# EAGLE design PGTNX05_daisy (EAGLE 9.6.0)
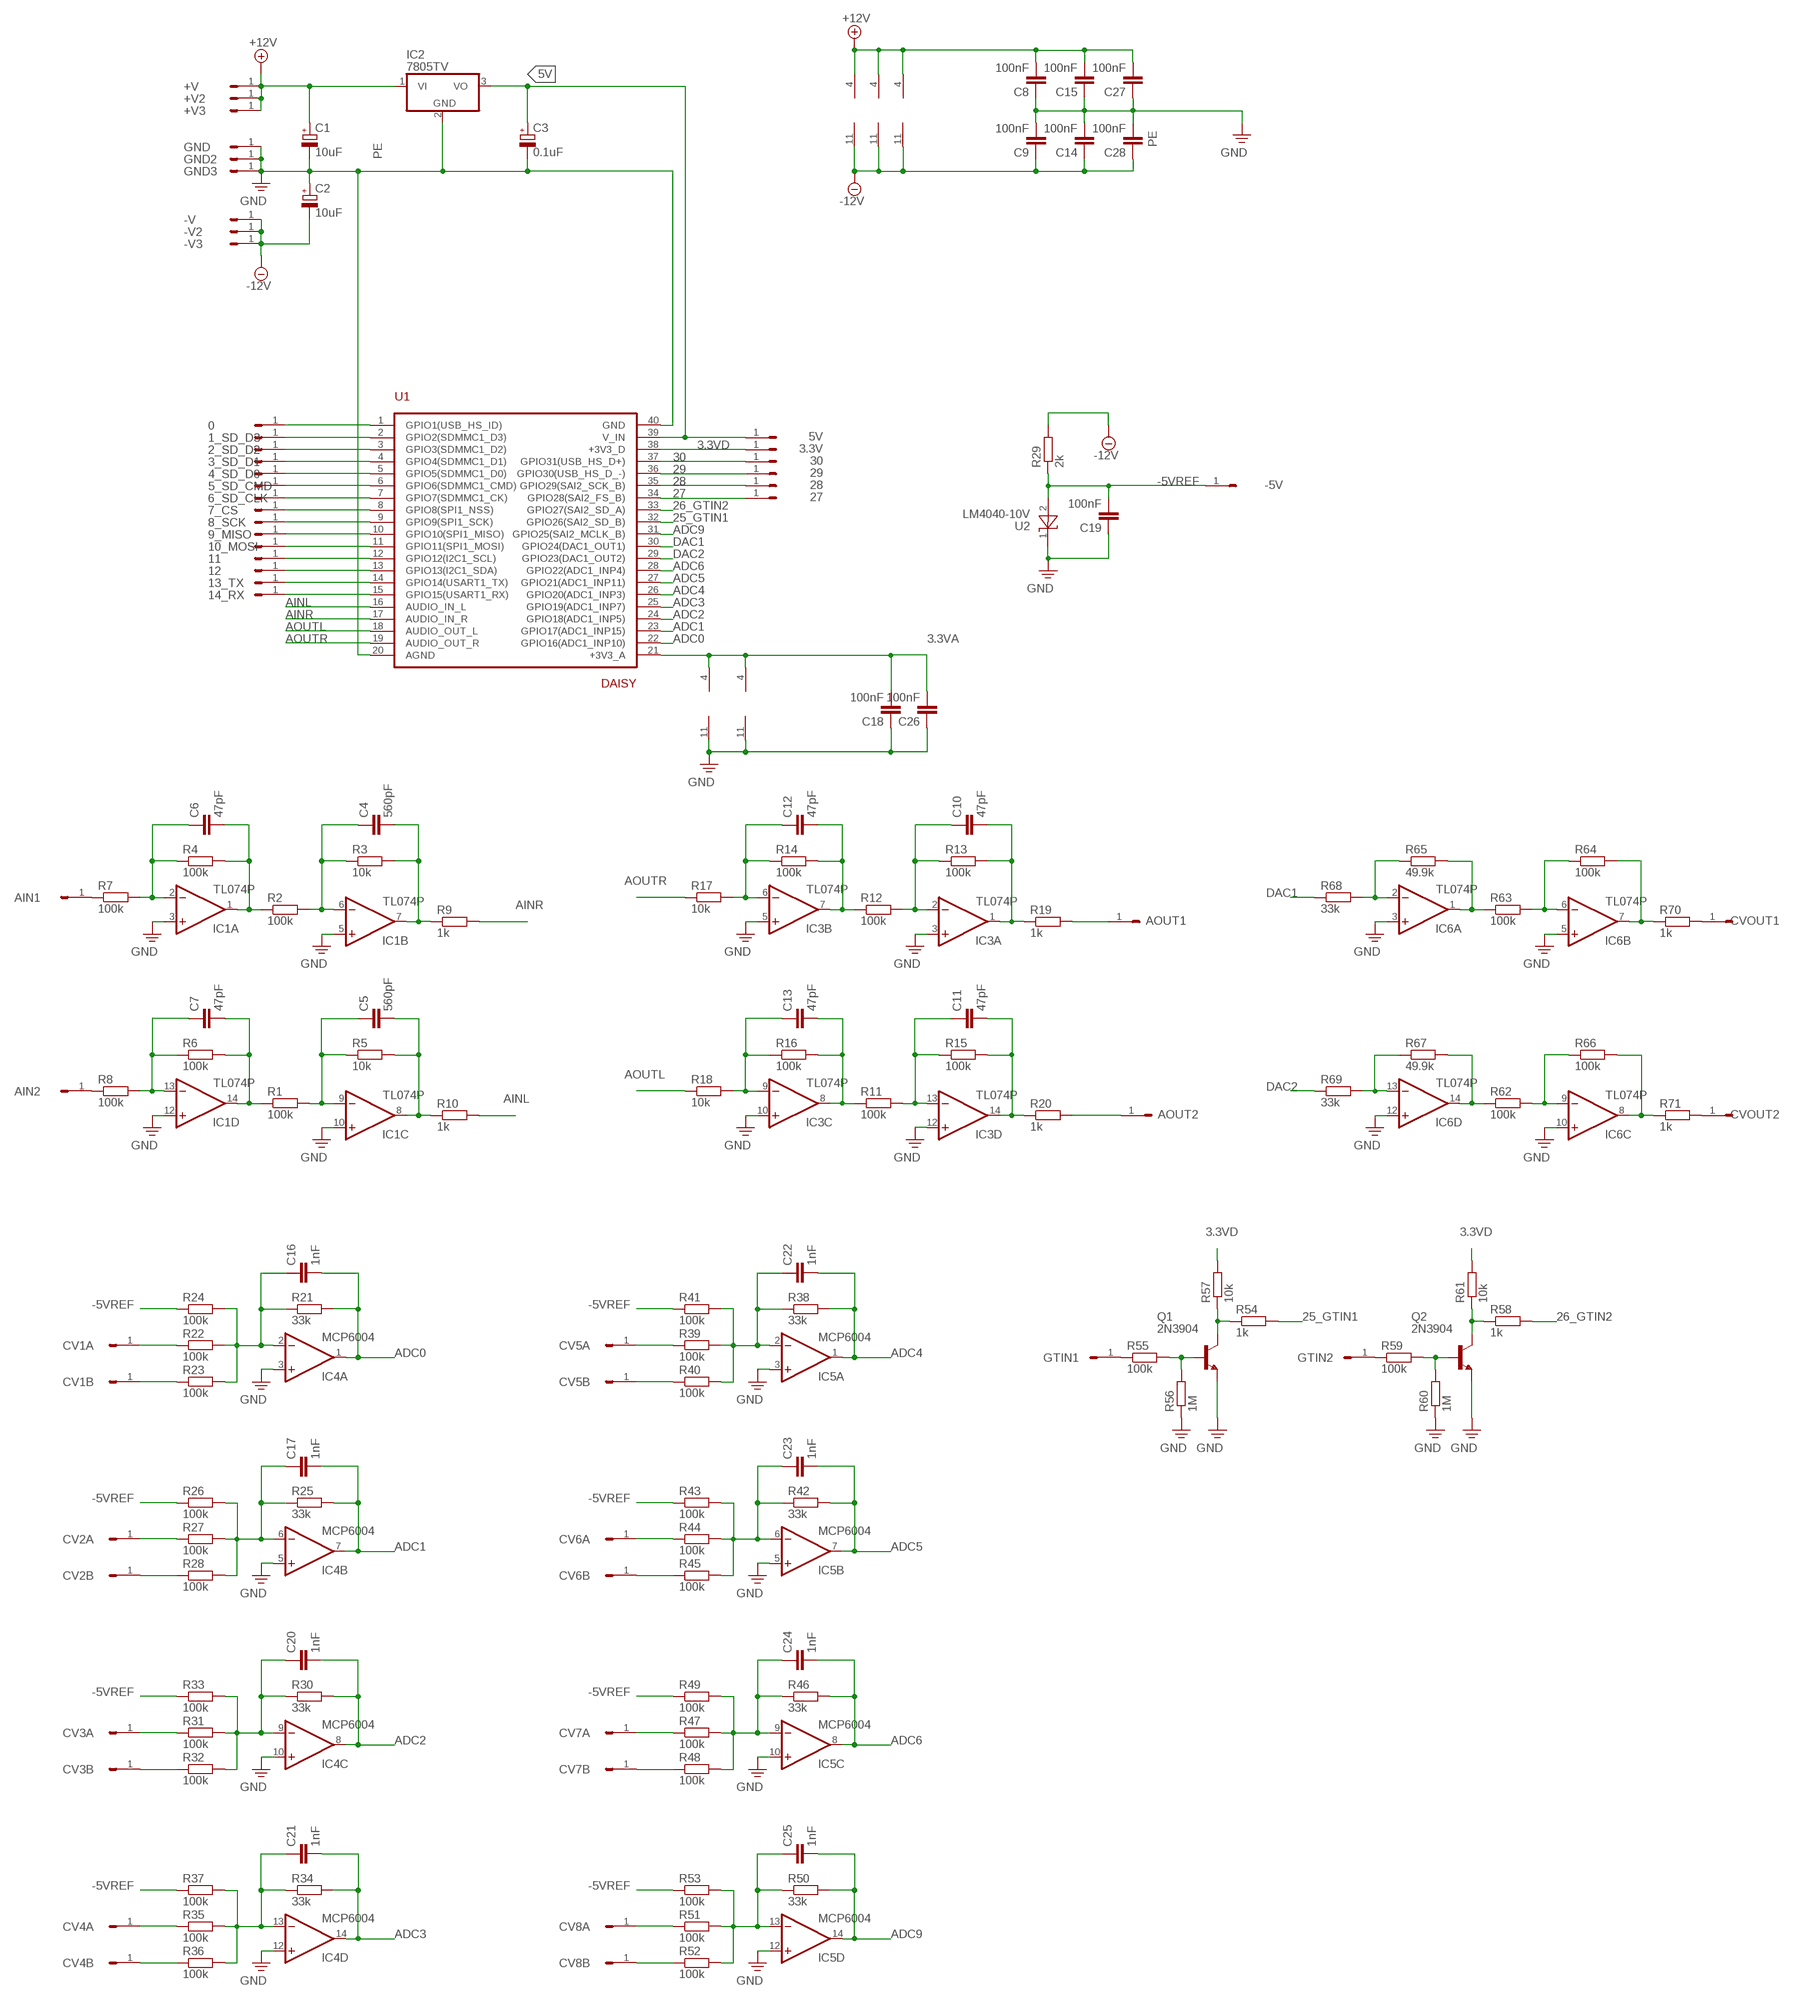
[diagram p0: schematic, sheet 1]

## Parts
0  HEADER/MALE/01  [HEADER/MALE/01]
1_SD_D3  HEADER/MALE/01  [HEADER/MALE/01]
2_SD_D2  HEADER/MALE/01  [HEADER/MALE/01]
3.3V  HEADER/MALE/01  [HEADER/MALE/01]
3_SD_D1  HEADER/MALE/01  [HEADER/MALE/01]
4_SD_D0  HEADER/MALE/01  [HEADER/MALE/01]
5_SD_CMD  HEADER/MALE/01  [HEADER/MALE/01]
5V  HEADER/MALE/01  [HEADER/MALE/01]
6_SD_CLK  HEADER/MALE/01  [HEADER/MALE/01]
7_CS  HEADER/MALE/01  [HEADER/MALE/01]
8_SCK  HEADER/MALE/01  [HEADER/MALE/01]
9_MISO  HEADER/MALE/01  [HEADER/MALE/01]
10_MOSI  HEADER/MALE/01  [HEADER/MALE/01]
11  HEADER/MALE/01  [HEADER/MALE/01]
12  HEADER/MALE/01  [HEADER/MALE/01]
13_TX  HEADER/MALE/01  [HEADER/MALE/01]
14_RX  HEADER/MALE/01  [HEADER/MALE/01]
27  HEADER/MALE/01  [HEADER/MALE/01]
28  HEADER/MALE/01  [HEADER/MALE/01]
29  HEADER/MALE/01  [HEADER/MALE/01]
30  HEADER/MALE/01  [HEADER/MALE/01]
+V  HEADER/MALE/01  [HEADER/MALE/01]
+V2  HEADER/MALE/01  [HEADER/MALE/01]
+V3  HEADER/MALE/01  [HEADER/MALE/01]
-5V  HEADER/MALE/01  [HEADER/MALE/01]
-V  HEADER/MALE/01  [HEADER/MALE/01]
-V2  HEADER/MALE/01  [HEADER/MALE/01]
-V3  HEADER/MALE/01  [HEADER/MALE/01]
AIN1  HEADER/MALE/01  [HEADER/MALE/01]
AIN2  HEADER/MALE/01  [HEADER/MALE/01]
AOUT1  HEADER/MALE/01  [HEADER/MALE/01]
AOUT2  HEADER/MALE/01  [HEADER/MALE/01]
C1  10uF  CAPACITOR/POLARIZEDE2.5-6  [E2,5-6]
C2  10uF  CAPACITOR/POLARIZEDE2.5-6  [E2,5-6]
C3  0.1uF  CAPACITOR/POLARIZEDE2.5-6  [E2,5-6]
C4  560pF  CAPACITORCERAMICDISC/5  [CERAMICDISC/5]
C5  560pF  CAPACITORCERAMICDISC/5  [CERAMICDISC/5]
C6  47pF  CAPACITORCERAMICDISC/5  [CERAMICDISC/5]
C7  47pF  CAPACITORCERAMICDISC/5  [CERAMICDISC/5]
C8  100nF  CAPACITORCERAMICDISC/5  [CERAMICDISC/5]
C9  100nF  CAPACITORCERAMICDISC/5  [CERAMICDISC/5]
C10  47pF  CAPACITORCERAMICDISC/5  [CERAMICDISC/5]
C11  47pF  CAPACITORCERAMICDISC/5  [CERAMICDISC/5]
C12  47pF  CAPACITORCERAMICDISC/5  [CERAMICDISC/5]
C13  47pF  CAPACITORCERAMICDISC/5  [CERAMICDISC/5]
C14  100nF  CAPACITORCERAMICDISC/5  [CERAMICDISC/5]
C15  100nF  CAPACITORCERAMICDISC/5  [CERAMICDISC/5]
C16  1nF  CAPACITORCERAMICDISC/5  [CERAMICDISC/5]
C17  1nF  CAPACITORCERAMICDISC/5  [CERAMICDISC/5]
C18  100nF  CAPACITORCERAMICDISC/5  [CERAMICDISC/5]
C19  100nF  CAPACITORCERAMICDISC/5  [CERAMICDISC/5]
C20  1nF  CAPACITORCERAMICDISC/5  [CERAMICDISC/5]
C21  1nF  CAPACITORCERAMICDISC/5  [CERAMICDISC/5]
C22  1nF  CAPACITORCERAMICDISC/5  [CERAMICDISC/5]
C23  1nF  CAPACITORCERAMICDISC/5  [CERAMICDISC/5]
C24  1nF  CAPACITORCERAMICDISC/5  [CERAMICDISC/5]
C25  1nF  CAPACITORCERAMICDISC/5  [CERAMICDISC/5]
C26  100nF  CAPACITORCERAMICDISC/5  [CERAMICDISC/5]
C27  100nF  CAPACITORCERAMICDISC/5  [CERAMICDISC/5]
C28  100nF  CAPACITORCERAMICDISC/5  [CERAMICDISC/5]
CV1A  HEADER/MALE/01  [HEADER/MALE/01]
CV1B  HEADER/MALE/01  [HEADER/MALE/01]
CV2A  HEADER/MALE/01  [HEADER/MALE/01]
CV2B  HEADER/MALE/01  [HEADER/MALE/01]
CV3A  HEADER/MALE/01  [HEADER/MALE/01]
CV3B  HEADER/MALE/01  [HEADER/MALE/01]
CV4A  HEADER/MALE/01  [HEADER/MALE/01]
CV4B  HEADER/MALE/01  [HEADER/MALE/01]
CV5A  HEADER/MALE/01  [HEADER/MALE/01]
CV5B  HEADER/MALE/01  [HEADER/MALE/01]
CV6A  HEADER/MALE/01  [HEADER/MALE/01]
CV6B  HEADER/MALE/01  [HEADER/MALE/01]
CV7A  HEADER/MALE/01  [HEADER/MALE/01]
CV7B  HEADER/MALE/01  [HEADER/MALE/01]
CV8A  HEADER/MALE/01  [HEADER/MALE/01]
CV8B  HEADER/MALE/01  [HEADER/MALE/01]
CVOUT1  HEADER/MALE/01  [HEADER/MALE/01]
CVOUT2  HEADER/MALE/01  [HEADER/MALE/01]
GND  HEADER/MALE/01  [HEADER/MALE/01]
GND2  HEADER/MALE/01  [HEADER/MALE/01]
GND3  HEADER/MALE/01  [HEADER/MALE/01]
GTIN1  HEADER/MALE/01  [HEADER/MALE/01]
GTIN2  HEADER/MALE/01  [HEADER/MALE/01]
IC1  TL074P  [DIL14]
IC2  7805TV  [TO220V]
IC3  TL074P  [DIL14]
IC4  MCP6004  TL074P  [DIL14]
IC5  MCP6004  TL074P  [DIL14]
IC6  TL074P  [DIL14]
Q1  2N3904  [TO92]
Q2  2N3904  [TO92]
R1  100k  RESISTORRESISTOR/UPRIGHT/7.5  [RESISTOR/7.5]
R2  100k  RESISTORRESISTOR/UPRIGHT/7.5  [RESISTOR/7.5]
R3  10k  RESISTORRESISTOR/UPRIGHT/7.5  [RESISTOR/7.5]
R4  100k  RESISTORRESISTOR/UPRIGHT/7.5  [RESISTOR/7.5]
R5  10k  RESISTORRESISTOR/UPRIGHT/7.5  [RESISTOR/7.5]
R6  100k  RESISTORRESISTOR/UPRIGHT/7.5  [RESISTOR/7.5]
R7  100k  RESISTORRESISTOR/UPRIGHT/7.5  [RESISTOR/7.5]
R8  100k  RESISTORRESISTOR/UPRIGHT/7.5  [RESISTOR/7.5]
R9  1k  RESISTORRESISTOR/UPRIGHT/7.5  [RESISTOR/7.5]
R10  1k  RESISTORRESISTOR/UPRIGHT/7.5  [RESISTOR/7.5]
R11  100k  RESISTORRESISTOR/UPRIGHT/7.5  [RESISTOR/7.5]
R12  100k  RESISTORRESISTOR/UPRIGHT/7.5  [RESISTOR/7.5]
R13  100k  RESISTORRESISTOR/UPRIGHT/7.5  [RESISTOR/7.5]
R14  100k  RESISTORRESISTOR/UPRIGHT/7.5  [RESISTOR/7.5]
R15  100k  RESISTORRESISTOR/UPRIGHT/7.5  [RESISTOR/7.5]
R16  100k  RESISTORRESISTOR/UPRIGHT/7.5  [RESISTOR/7.5]
R17  10k  RESISTORRESISTOR/UPRIGHT/7.5  [RESISTOR/7.5]
R18  10k  RESISTORRESISTOR/UPRIGHT/7.5  [RESISTOR/7.5]
R19  1k  RESISTORRESISTOR/UPRIGHT/7.5  [RESISTOR/7.5]
R20  1k  RESISTORRESISTOR/UPRIGHT/7.5  [RESISTOR/7.5]
R21  33k  RESISTORRESISTOR/UPRIGHT/7.5  [RESISTOR/7.5]
R22  100k  RESISTORRESISTOR/UPRIGHT/7.5  [RESISTOR/7.5]
R23  100k  RESISTORRESISTOR/UPRIGHT/7.5  [RESISTOR/7.5]
R24  100k  RESISTORRESISTOR/UPRIGHT/7.5  [RESISTOR/7.5]
R25  33k  RESISTORRESISTOR/UPRIGHT/7.5  [RESISTOR/7.5]
R26  100k  RESISTORRESISTOR/UPRIGHT/7.5  [RESISTOR/7.5]
R27  100k  RESISTORRESISTOR/UPRIGHT/7.5  [RESISTOR/7.5]
R28  100k  RESISTORRESISTOR/UPRIGHT/7.5  [RESISTOR/7.5]
R29  2k  RESISTORRESISTOR/UPRIGHT/7.5  [RESISTOR/7.5]
R30  33k  RESISTORRESISTOR/UPRIGHT/7.5  [RESISTOR/7.5]
R31  100k  RESISTORRESISTOR/UPRIGHT/7.5  [RESISTOR/7.5]
R32  100k  RESISTORRESISTOR/UPRIGHT/7.5  [RESISTOR/7.5]
R33  100k  RESISTORRESISTOR/UPRIGHT/7.5  [RESISTOR/7.5]
R34  33k  RESISTORRESISTOR/UPRIGHT/7.5  [RESISTOR/7.5]
R35  100k  RESISTORRESISTOR/UPRIGHT/7.5  [RESISTOR/7.5]
R36  100k  RESISTORRESISTOR/UPRIGHT/7.5  [RESISTOR/7.5]
R37  100k  RESISTORRESISTOR/UPRIGHT/7.5  [RESISTOR/7.5]
R38  33k  RESISTORRESISTOR/UPRIGHT/7.5  [RESISTOR/7.5]
R39  100k  RESISTORRESISTOR/UPRIGHT/7.5  [RESISTOR/7.5]
R40  100k  RESISTORRESISTOR/UPRIGHT/7.5  [RESISTOR/7.5]
R41  100k  RESISTORRESISTOR/UPRIGHT/7.5  [RESISTOR/7.5]
R42  33k  RESISTORRESISTOR/UPRIGHT/7.5  [RESISTOR/7.5]
R43  100k  RESISTORRESISTOR/UPRIGHT/7.5  [RESISTOR/7.5]
R44  100k  RESISTORRESISTOR/UPRIGHT/7.5  [RESISTOR/7.5]
R45  100k  RESISTORRESISTOR/UPRIGHT/7.5  [RESISTOR/7.5]
R46  33k  RESISTORRESISTOR/UPRIGHT/7.5  [RESISTOR/7.5]
R47  100k  RESISTORRESISTOR/UPRIGHT/7.5  [RESISTOR/7.5]
R48  100k  RESISTORRESISTOR/UPRIGHT/7.5  [RESISTOR/7.5]
R49  100k  RESISTORRESISTOR/UPRIGHT/7.5  [RESISTOR/7.5]
R50  33k  RESISTORRESISTOR/UPRIGHT/7.5  [RESISTOR/7.5]
R51  100k  RESISTORRESISTOR/UPRIGHT/7.5  [RESISTOR/7.5]
R52  100k  RESISTORRESISTOR/UPRIGHT/7.5  [RESISTOR/7.5]
R53  100k  RESISTORRESISTOR/UPRIGHT/7.5  [RESISTOR/7.5]
R54  1k  RESISTORRESISTOR/UPRIGHT/7.5  [RESISTOR/7.5]
R55  100k  RESISTORRESISTOR/UPRIGHT/7.5  [RESISTOR/7.5]
R56  1M  RESISTORRESISTOR/UPRIGHT/7.5  [RESISTOR/7.5]
R57  10k  RESISTORRESISTOR/UPRIGHT/7.5  [RESISTOR/7.5]
R58  1k  RESISTORRESISTOR/UPRIGHT/7.5  [RESISTOR/7.5]
R59  100k  RESISTORRESISTOR/UPRIGHT/7.5  [RESISTOR/7.5]
R60  1M  RESISTORRESISTOR/UPRIGHT/7.5  [RESISTOR/7.5]
R61  10k  RESISTORRESISTOR/UPRIGHT/7.5  [RESISTOR/7.5]
R62  100k  RESISTORRESISTOR/UPRIGHT/7.5  [RESISTOR/7.5]
R63  100k  RESISTORRESISTOR/UPRIGHT/7.5  [RESISTOR/7.5]
R64  100k  RESISTORRESISTOR/UPRIGHT/7.5  [RESISTOR/7.5]
R65  49.9k  RESISTORRESISTOR/UPRIGHT/7.5  [RESISTOR/7.5]
R66  100k  RESISTORRESISTOR/UPRIGHT/7.5  [RESISTOR/7.5]
R67  49.9k  RESISTORRESISTOR/UPRIGHT/7.5  [RESISTOR/7.5]
R68  33k  RESISTORRESISTOR/UPRIGHT/7.5  [RESISTOR/7.5]
R69  33k  RESISTORRESISTOR/UPRIGHT/7.5  [RESISTOR/7.5]
R70  1k  RESISTORRESISTOR/UPRIGHT/7.5  [RESISTOR/7.5]
R71  1k  RESISTORRESISTOR/UPRIGHT/7.5  [RESISTOR/7.5]
U1  DAISY  ES_DAISY_SEED_REV4  [ES_DAISY_SEED]
U2  LM4040-10V  LM4040CYM3-2.5  [SOT-23]

## Nets
3.3VA: C18.2 C26.2 IC4.4(P:V+) IC5.4(P:V+) U1.21(+3V3_A)
3.3VD: 3.3V.1 R57.2 R61.2 U1.38(+3V3_D)
5V: 5V.1 C3.+ IC2.3(VO) U1.39(V_IN)
25_GTIN1: R54.2 U1.32(GPIO26(SAI2_SD_B))
26_GTIN2: R58.2 U1.33(GPIO27(SAI2_SD_A))
27: 27.1 U1.34(GPIO28(SAI2_FS_B))
28: 28.1 U1.35(GPIO29(SAI2_SCK_B))
29: 29.1 U1.36(GPIO30(USB_HS_D_-))
30: 30.1 U1.37(GPIO31(USB_HS_D+))
+12V: +V2.1 +V3.1 +V.1 C1.+ C8.2 C15.2 C27.2 IC1.4(P:V+) IC2.1(VI) IC3.4(P:V+) IC6.4(P:V+)
-5VREF: -5V.1 C19.2 R24.1 R26.1 R29.1 R33.1 R37.1 R41.1 R43.1 R49.1 R53.1 U2.2(A)
-12V: -V2.1 -V3.1 -V.1 C2.- C9.1 C14.1 C28.1 IC1.11(P:V-) IC3.11(P:V-) IC6.11(P:V-) R29.2
ADC0: C16.2 IC4.1(A:OUT) R21.2 U1.22(GPIO16(ADC1_INP10))
ADC1: C17.2 IC4.7(B:OUT) R25.2 U1.23(GPIO17(ADC1_INP15))
ADC2: C20.2 IC4.8(C:OUT) R30.2 U1.24(GPIO18(ADC1_INP5))
ADC3: C21.2 IC4.14(D:OUT) R34.2 U1.25(GPIO19(ADC1_INP7))
ADC4: C22.2 IC5.1(A:OUT) R38.2 U1.26(GPIO20(ADC1_INP3))
ADC5: C23.2 IC5.7(B:OUT) R42.2 U1.27(GPIO21(ADC1_INP11))
ADC6: C24.2 IC5.8(C:OUT) R46.2 U1.28(GPIO22(ADC1_INP4))
ADC9: C25.2 IC5.14(D:OUT) R50.2 U1.31(GPIO25(SAI2_MCLK_B))
AINL: R10.2 U1.16(AUDIO_IN_L)
AINR: R9.2 U1.17(AUDIO_IN_R)
AOUTL: R18.1 U1.18(AUDIO_OUT_L)
AOUTR: R17.1 U1.19(AUDIO_OUT_R)
DAC1: R68.1 U1.30(GPIO24(DAC1_OUT1))
DAC2: R69.1 U1.29(GPIO23(DAC1_OUT2))
N$1: CV2A.1 R27.1
N$2: C7.2 IC1.14(D:OUT) R1.1 R6.2
N$3: C6.2 IC1.1(A:OUT) R2.1 R4.2
N$4: C4.1 IC1.6(B:-IN) R2.2 R3.1
N$5: C5.1 IC1.9(C:-IN) R1.2 R5.1
N$6: AIN1.1 R7.1
N$7: AIN2.1 R8.1
N$8: C7.1 IC1.13(D:-IN) R6.1 R8.2
N$9: C5.2 IC1.8(C:OUT) R5.2 R10.1
N$10: C4.2 IC1.7(B:OUT) R3.2 R9.1
N$11: AOUT1.1 R19.2
N$12: C12.2 IC3.7(B:OUT) R12.1 R14.2
N$13: C6.1 IC1.2(A:-IN) R4.1 R7.2
N$14: C10.1 IC3.2(A:-IN) R12.2 R13.1
N$15: C13.2 IC3.8(C:OUT) R11.1 R16.2
N$16: C11.1 IC3.13(D:-IN) R11.2 R15.1
N$17: C13.1 IC3.9(C:-IN) R16.1 R18.2
N$18: C11.2 IC3.14(D:OUT) R15.2 R20.1
N$19: C10.2 IC3.1(A:OUT) R13.2 R19.1
N$20: C12.1 IC3.6(B:-IN) R14.1 R17.2
N$21: AOUT2.1 R20.2
N$22: CV1A.1 R22.1
N$23: 14_RX.1 U1.15(GPIO15(USART1_RX))
N$24: C16.1 IC4.2(A:-IN) R21.1 R22.2 R23.2 R24.2
N$25: GTIN2.1 R59.1
N$26: CV2B.1 R28.1
N$27: CV1B.1 R23.1
N$28: 13_TX.1 U1.14(GPIO14(USART1_TX))
N$29: C17.1 IC4.6(B:-IN) R25.1 R26.2 R27.2 R28.2
N$30: C21.1 IC4.13(D:-IN) R34.1 R35.2 R36.2 R37.2
N$31: CV4A.1 R35.1
N$32: CV4B.1 R36.1
N$33: 10_MOSI.1 U1.11(GPIO11(SPI1_MOSI))
N$34: CV3B.1 R32.1
N$35: CV3A.1 R31.1
N$36: C20.1 IC4.9(C:-IN) R30.1 R31.2 R32.2 R33.2
N$37: 9_MISO.1 U1.10(GPIO10(SPI1_MISO))
N$38: C22.1 IC5.2(A:-IN) R38.1 R39.2 R40.2 R41.2
N$39: 8_SCK.1 U1.9(GPIO9(SPI1_SCK))
N$40: CV5B.1 R40.1
N$41: CV5A.1 R39.1
N$42: 7_CS.1 U1.8(GPIO8(SPI1_NSS))
N$43: C23.1 IC5.6(B:-IN) R42.1 R43.2 R44.2 R45.2
N$44: CV6A.1 R44.1
N$45: CV6B.1 R45.1
N$46: C25.1 IC5.13(D:-IN) R50.1 R51.2 R52.2 R53.2
N$47: 6_SD_CLK.1 U1.7(GPIO7(SDMMC1_CK))
N$48: CV8A.1 R51.1
N$49: CV8B.1 R52.1
N$50: CV7B.1 R48.1
N$51: CV7A.1 R47.1
N$52: C24.1 IC5.9(C:-IN) R46.1 R47.2 R48.2 R49.2
N$53: 5_SD_CMD.1 U1.6(GPIO6(SDMMC1_CMD))
N$54: GTIN1.1 R55.1
N$55: Q1.2(B) R55.2 R56.2
N$56: Q1.1(C) R54.1 R57.1
N$58: Q2.2(B) R59.2 R60.2
N$59: Q2.1(C) R58.1 R61.1
N$61: 4_SD_D0.1 U1.5(GPIO5(SDMMC1_D0))
N$62: 3_SD_D1.1 U1.4(GPIO4(SDMMC1_D1))
N$63: 2_SD_D2.1 U1.3(GPIO3(SDMMC1_D2))
N$64: 1_SD_D3.1 U1.2(GPIO2(SDMMC1_D3))
N$65: 0.1 U1.1(GPIO1(USB_HS_ID))
N$66: 11.1 U1.12(GPIO12(I2C1_SCL))
N$67: 12.1 U1.13(GPIO13(I2C1_SDA))
N$69: IC6.1(A:OUT) R63.1 R65.2
N$70: IC6.6(B:-IN) R63.2 R64.1
N$71: IC6.14(D:OUT) R62.1 R67.2
N$72: IC6.9(C:-IN) R62.2 R66.1
N$73: IC6.13(D:-IN) R67.1 R69.2
N$74: IC6.8(C:OUT) R66.2 R71.1
N$75: IC6.7(B:OUT) R64.2 R70.1
N$76: IC6.2(A:-IN) R65.1 R68.2
N$77: CVOUT1.1 R70.2
N$78: CVOUT2.1 R71.2
PE: C1.- C2.+ C3.- C8.1 C9.2 C14.2 C15.1 C18.1 C19.1 C26.1 C27.1 C28.2 GND2.1 GND3.1 GND.1 IC1.3(A:+IN) IC1.5(B:+IN) IC1.10(C:+IN) IC1.12(D:+IN) IC2.2(GND) IC3.3(A:+IN) IC3.5(B:+IN) IC3.10(C:+IN) IC3.12(D:+IN) IC4.3(A:+IN) IC4.5(B:+IN) IC4.10(C:+IN) IC4.11(P:V-) IC4.12(D:+IN) IC5.3(A:+IN) IC5.5(B:+IN) IC5.10(C:+IN) IC5.11(P:V-) IC5.12(D:+IN) IC6.3(A:+IN) IC6.5(B:+IN) IC6.10(C:+IN) IC6.12(D:+IN) Q1.3(E) Q2.3(E) R56.1 R60.1 U1.20(AGND) U1.40(GND) U2.1(C) ; supply symbol labelled GND

## Library data of the parts
0 1_SD_D3 2_SD_D2 3.3V 3_SD_D1 4_SD_D0 5_SD_CMD 5V 6_SD_CLK 7_CS 8_SCK 9_MISO 10_MOSI 11 12 13_TX 14_RX 27-30 +V +V2 +V3 -5V -V -V2 -V3 AIN1 AIN2 AOUT1 AOUT2 CV1A CV1B CV2A CV2B CV3A CV3B CV4A CV4B CV5A CV5B CV6A CV6B CV7A CV7B CV8A CV8B CVOUT1 CVOUT2 GND GND2 GND3 GTIN1 GTIN2 = connectors:HEADER/MALE/01; SPICEPREFIX: X
C1-C3 = capacitors:CAPACITOR/POLARIZED: POLARIZED CAPACITOR, European symbol; SPICEPREFIX: C
C4-C28 = capacitors:CAPACITOR: CAPACITOR, European symbol
IC1 IC3-IC6 = ic_analogue:TL074: OP AMP
IC2 = ic_voltage_reg:78*: Positive VOLTAGE REGULATOR Source: http://cache.national.com/ds/LM/LM78L05.pdf http://www.fairchildsemi.com/ds/LM/LM7805.pdf
Q1 Q2 = transistors:2N3904: NPN Transistor
R1-R71 = resistors:RESISTOR: RESISTOR, European symbol
U1 = Electrosmith-Boards:ES_DAISY_SEED_REV4; IPN: Daisy Seed
U2 = ic_voltage_reg:LM4040

## Board
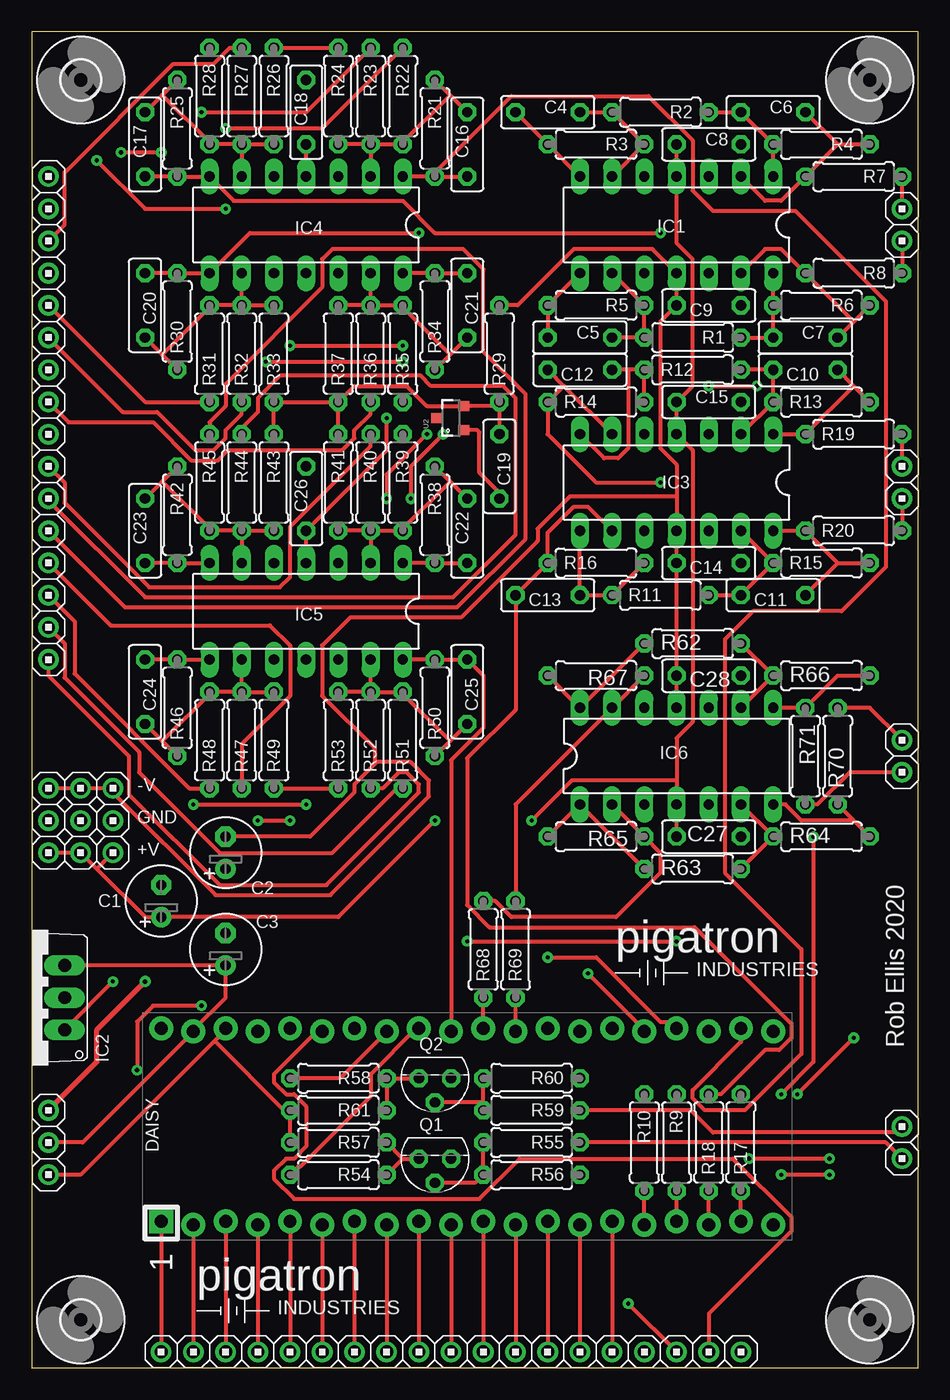
[diagram p1: board, top side]
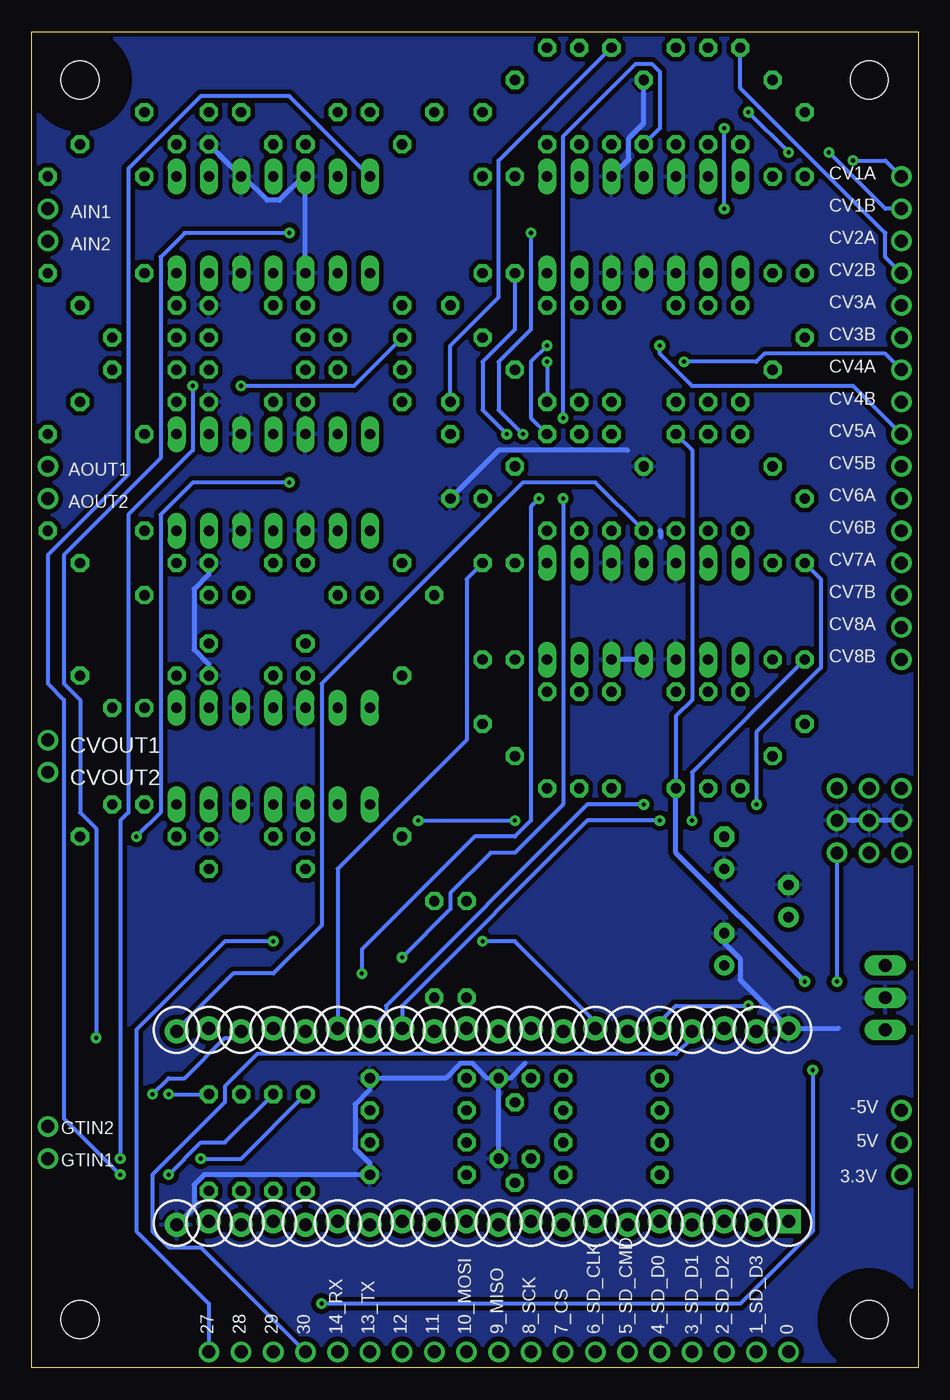
[diagram p2: board, bottom side, seen from below]

Size 69.9 x 105.4 mm. Coordinates in mm from the lower left corner, seen from the top.
Outline: 69.9,105.4 0,105.4 0,0 69.9,0 69.9,105.4
Copper layers (1*16): Top 0.0356mm / dielectric 1.5011mm / Bottom 0.0356mm
Design rules "pigatron": minimum track width 12mil, minimum drill 13mil, track to track 15mil, track to pad 10mil, pad to pad 10mil, via to via 10mil, smd to smd 6mil, copper to edge 15mil, drill to drill 10mil, minimum pad ring 12mil, minimum via ring 10mil, stop-mask expansion 4mil, vias tented up to drill 0mil, thermal gap 10mil

### Footprints (pad centres in the part's own frame; a part is rotated, then mirrored left to right if it is on the bottom)
HEADER/MALE/01 = drill 1.016: 1 0,0
E2,5-6 = drill 0.813 pad 1.6: + -1.27,0 | drill 0.813 pad 1.6 octagon: - 1.27,0
CERAMICDISC/5 = drill 0.813 octagon: 1 -2.54,0; 2 2.54,0
DIL14 = drill 0.813 long: 1 -7.62,-3.81; 2 -5.08,-3.81; 3 -2.54,-3.81; 4 0,-3.81; 5 2.54,-3.81; 6 5.08,-3.81; 7 7.62,-3.81; 8 7.62,3.81; 9 5.08,3.81; 10 2.54,3.81; 11 0,3.81; 12 -2.54,3.81; 13 -5.08,3.81; 14 -7.62,3.81
TO220V = drill 1.016 long: 1 -2.54,-2.54; 2 0,-2.54; 3 2.54,-2.54
TO92 = drill 0.813 octagon: 1 1.27,0; 2 0,1.905; 3 -1.27,0
RESISTOR/7.5 = drill 0.813 octagon: 1 -3.81,0; 2 3.81,0
ES_DAISY_SEED = drill 1.016 pad 1.88 square: 1 -7.493,24.13 | drill 1.016 pad 1.88: 2 -7.747,21.59; 3 -7.493,19.05; 4 -7.747,16.51; 5 -7.493,13.97; 6 -7.747,11.43; 7 -7.493,8.89; 8 -7.747,6.35; 9 -7.493,3.81; 10 -7.747,1.27; 11 -7.493,-1.27; 12 -7.747,-3.81; 13 -7.493,-6.35; 14 -7.747,-8.89; 15 -7.493,-11.43; 16 -7.747,-13.97; 17 -7.493,-16.51; 18 -7.747,-19.05; 19 -7.493,-21.59; 20 -7.747,-24.13; 21 7.493,-24.13; 22 7.747,-21.59; 23 7.493,-19.05; 24 7.747,-16.51; 25 7.493,-13.97; 26 7.747,-11.43; 27 7.493,-8.89; 28 7.747,-6.35; 29 7.493,-3.81; 30 7.747,-1.27; 31 7.493,1.27; 32 7.747,3.81; 33 7.493,6.35; 34 7.747,8.89; 35 7.493,11.43; 36 7.747,13.97; 37 7.493,16.51; 38 7.747,19.05; 39 7.493,21.59; 40 7.747,24.13
SOT-23 = smd 0.8 x 0.9: 1 -0.95,-1; 2 0.95,-1; 3 0,1.1
STANDOFF/3.0 = hole 3: 0,0

### Placement (x,y rotation side)
0  10.21,1.26 90 top
1_SD_D3  12.75,1.26 90 top
2_SD_D2  15.29,1.26 90 top
3.3V  1.32,15.23 270 top
3_SD_D1  17.83,1.26 90 top
4_SD_D0  20.37,1.26 90 top
5_SD_CMD  22.91,1.26 90 top
5V  1.32,17.77 180 top
6_SD_CLK  25.45,1.26 90 top
7_CS  27.99,1.26 90 top
8_SCK  30.53,1.26 90 top
9_MISO  33.07,1.26 90 top
10_MOSI  35.61,1.26 90 top
11  38.15,1.26 90 top
12  40.69,1.26 90 top
13_TX  43.23,1.26 90 top
14_RX  45.77,1.26 90 top
27  55.93,1.26 90 top
28  53.39,1.26 90 top
29  50.85,1.26 90 top
30  48.31,1.26 90 top
+V  6.4,40.63 0 top
+V2  3.86,40.63 180 top
+V3  1.32,40.63 180 top
-5V  1.32,20.31 0 top
-V  6.4,45.71 0 top
-V2  3.86,45.71 180 top
-V3  1.32,45.71 180 top
AIN1  68.63,91.43 180 top
AIN2  68.63,88.89 180 top
AOUT1  68.63,71.11 180 top
AOUT2  68.63,68.57 180 top
C1  10.21,36.82 90 top
C2  15.29,40.63 90 top
C3  15.29,33.01 90 top
C4  40.69,99.05 180 top
C5  43.23,81.27 180 top
C6  58.47,99.05 180 top
C7  61.01,81.27 180 top
C8  53.39,96.51 180 top
C9  53.39,83.81 0 top
C10  61.01,78.73 0 top
C11  58.47,60.95 0 top
C12  43.23,78.73 0 top
C13  40.69,60.95 0 top
C14  53.39,63.49 0 top
C15  53.39,76.19 180 top
C16  34.34,96.51 270 top
C17  8.94,96.51 270 top
C18  21.64,99.05 270 top
C19  36.88,71.11 90 top
C20  8.94,83.81 90 top
C21  34.34,83.81 90 top
C22  34.34,66.03 270 top
C23  8.94,66.03 270 top
C24  8.94,53.33 90 top
C25  34.34,53.33 90 top
C26  21.64,68.57 270 top
C27  53.39,41.9 180 top
C28  53.39,54.6 0 top
CV1A  1.32,93.97 0 top
CV1B  1.32,91.43 0 top
CV2A  1.32,88.89 0 top
CV2B  1.32,86.35 0 top
CV3A  1.32,83.81 0 top
CV3B  1.32,81.27 0 top
CV4A  1.32,78.73 0 top
CV4B  1.32,76.19 0 top
CV5A  1.32,73.65 0 top
CV5B  1.32,71.11 0 top
CV6A  1.32,68.57 0 top
CV6B  1.32,66.03 0 top
CV7A  1.32,63.49 0 top
CV7B  1.32,60.95 0 top
CV8A  1.32,58.41 0 top
CV8B  1.32,55.87 0 top
CVOUT1  68.63,49.52 180 top
CVOUT2  68.63,46.98 180 top
GND  6.4,43.17 0 top
GND2  1.32,43.17 180 top
GND3  3.86,43.17 180 top
GTIN1  68.63,16.5 180 top
GTIN2  68.63,19.04 180 top
IC1  50.85,90.16 180 top
IC2  0.05,29.2 90 top
IC3  50.85,69.84 180 top
IC4  21.64,90.16 180 top
IC5  21.64,59.68 180 top
IC6  50.85,48.25 0 top
Q1  31.8,16.5 180 top
Q2  31.8,22.85 180 top
R1  52.12,81.27 180 top
R2  49.58,99.05 180 top
R3  44.5,96.51 180 top
R4  62.28,96.51 180 top
R5  44.5,83.81 180 top
R6  62.28,83.81 180 top
R7  64.82,93.97 180 top
R8  64.82,86.35 180 top
R9  50.85,17.77 270 top
R10  48.31,17.77 270 top
R11  49.58,60.95 0 top
R12  52.12,78.73 0 top
R13  62.28,76.19 0 top
R14  44.5,76.19 0 top
R15  62.28,63.49 0 top
R16  44.5,63.49 0 top
R17  55.93,17.77 90 top
R18  53.39,17.77 90 top
R19  64.82,73.65 0 top
R20  64.82,66.03 0 top
R21  31.8,97.78 270 top
R22  29.26,100.32 270 top
R23  26.72,100.32 270 top
R24  24.18,100.32 270 top
R25  11.48,97.78 270 top
R26  19.1,100.32 270 top
R27  16.56,100.32 270 top
R28  14.02,100.32 270 top
R29  36.88,80 90 top
R30  11.48,82.54 90 top
R31  14.02,80 90 top
R32  16.56,80 90 top
R33  19.1,80 90 top
R34  31.8,82.54 90 top
R35  29.26,80 90 top
R36  26.72,80 90 top
R37  24.18,80 90 top
R38  31.8,67.3 270 top
R39  29.26,69.84 270 top
R40  26.72,69.84 270 top
R41  24.18,69.84 270 top
R42  11.48,67.3 270 top
R43  19.1,69.84 270 top
R44  16.56,69.84 270 top
R45  14.02,69.84 270 top
R46  11.48,52.06 90 top
R47  16.56,49.52 90 top
R48  14.02,49.52 90 top
R49  19.1,49.52 90 top
R50  31.8,52.06 90 top
R51  29.26,49.52 90 top
R52  26.72,49.52 90 top
R53  24.18,49.52 90 top
R54  24.18,15.23 180 top
R55  39.42,17.77 180 top
R56  39.42,15.23 180 top
R57  24.18,17.77 180 top
R58  24.18,22.85 180 top
R59  39.42,20.31 180 top
R60  39.42,22.85 180 top
R61  24.18,20.31 180 top
R62  52.12,57.14 0 top
R63  52.12,39.36 0 top
R64  62.28,41.9 0 top
R65  44.5,41.9 180 top
R66  62.28,54.6 0 top
R67  44.5,54.6 180 top
R68  35.61,33.01 90 top
R69  38.15,33.01 90 top
R70  63.55,48.25 90 top
R71  61.01,48.25 270 top
U1  34.34,19.04 90 top
U2  33.07,74.92 90 top
U$1  [PIGATRON-LOGO]  21.89,6.09 0 top
U$2  [STANDOFF/3.0]  66.09,3.8 180 top
U$3  [STANDOFF/3.0]  3.86,3.8 180 top
U$4  [STANDOFF/3.0]  3.86,101.59 0 top
U$5  [PIGATRON-LOGO]  54.91,32.76 0 top
U$7  [STANDOFF/3.0]  66.09,101.59 0 top

### Tracks (layer width: path | path; a pad name or v marks a point on that pad's centre or on a via)
3.3VA  (via drill 0.33)
  Top 0.305: IC4.4 C18.2 | IC5.4 C26.2 27.99,72.38 v27.99,74.92
  Bottom 0.305: C18.2 20.37,97.78 20.37,102.22 21.01,102.86 22.28,102.86 27.99,97.14 v27.99,74.92 | C26.2 25.45,69.84 31.17,69.84 47.04,53.97 47.04,34.91 50.85,31.1 54.03,31.1 58.47,26.66 U1.21
3.3VD
  Top 0.305: R57.2 R61.2 19.89,20.31 14.42,25.79 | 3.3V.1 3.86,15.23 14.42,25.79 | 14.42,25.79 15.29,26.66 U1.38
5V
  Top 0.305: IC2.3 C3.+ 15.29,29.2 12.75,26.66 U1.39 12.75,26.5 4.02,17.77 5V.1
25_GTIN1
  Top 0.305: R54.2 21.01,15.87 21.16,15.87 26.72,21.42 26.72,23.17 30.21,26.66 30.53,26.66 U1.32
26_GTIN2
  Top 0.305: R58.2 24.34,22.85 27.99,26.5 U1.33
27  (via drill 0.33)
  Top 0.305: v34.34,33.65 v50.85,33.65
  Bottom 0.305: 27.1 55.93,5.07 61.65,10.79 61.65,26.66 54.66,33.65 v50.85,33.65 | v34.34,33.65 31.8,33.65 25.45,27.29 U1.34
28
  Top 0.305: 28.1 53.39,4.28 59.9,10.79 59.9,11.9 55.3,16.5 38.47,16.5 35.29,13.33 20.69,13.33 19.1,14.91 19.1,15.55 20.05,16.5 20.69,16.5 21.64,17.45 21.64,20.63 20.69,21.58 20.05,21.58 19.1,22.53 19.1,23.17 22.43,26.5 22.91,26.5 U1.35
29  (via drill 0.33)
  Top 0.305: v47.04,5.07 29.1 | v8.31,23.48 8.31,27.29 9.58,28.56 v13.39,28.56
  Bottom 0.305: v47.04,5.07 14.02,5.07 8.31,10.79 v8.31,23.48 | v13.39,28.56 19.1,28.56 20.37,27.29 U1.36
30
  Bottom 0.305: 30.1 56.57,9.52 59.11,9.52 60.38,10.79 60.38,15.23 54.66,20.94 54.66,22.21 52.12,24.75 19.1,24.75 17.83,26.02 U1.37
+12V  (via drill 0.33)
  Top 0.305: C27.2 IC6.4 50.85,46.34 | C8.2 IC1.4 50.85,88.73 52.12,87.46 52.12,77.46 C15.2 IC3.4 52.12,72.38 52.12,50.95 50.85,49.68 50.85,46.34 | 5.13,39.36 +V2.1 +V3.1 | 5.13,39.36 8.94,35.55 C1.+ 24.18,35.55 v31.8,43.17 | 5.13,39.36 +V.1 | v6.4,30.47 IC2.1 | v39.42,43.17 42.6,46.34 50.85,46.34
  Bottom 0.305: +V.1 v6.4,30.47 | v39.42,43.17 v31.8,43.17
-5VREF  (via drill 0.35)
  Top 0.305: R49.1 R53.1 | C19.2 R29.1 36.56,75.87 34.18,75.87 U2.2 34.02,75.87 31.17,75.87 29.58,77.46 25.45,77.46 R37.1 | R41.1 R37.1 | R43.1 R33.1 R37.1 | R26.1 R24.1
  Top 0.406: -5V.1 5.13,24.12 5.13,26.66 v8.94,30.47
  Bottom 0.305: R24.1 33.07,95.24 33.07,84.44 36.88,80.63 R29.1 | R49.1 19.1,51.43 17.83,52.7 17.83,72.38 R43.1
  Bottom 0.406: v8.94,30.47 19.1,40.63 R49.1
-12V
  Top 0.305: C2.- 21.96,41.9 25.45,45.39 25.45,46.03 27.12,47.69 | 27.12,47.69 27.2,47.77 29.9,47.77 31.32,46.34 31.32,45.08 23.55,37.3 14.5,37.3 6.4,45.39 -V.1 -V2.1 -V3.1 | IC6.11 C28.1 C14.1 IC3.11 50.85,68.73 | R29.2 38.31,83.81 42.76,88.25 48.95,88.25 IC1.11 C9.1 49.58,82.54 49.58,72.54 50.85,71.27 50.85,68.73 | 50.85,68.73 42.44,68.73 39.9,66.19 39.9,65.24 33.87,59.2 25.13,59.2 22.91,56.98 22.91,53.01 27.04,48.89 27.04,47.77 27.12,47.69
ADC0
  Top 0.305: C16.2 R21.2 31.48,93.97 | 31.48,93.97 IC4.1 | U1.22 55.93,25.71 52.12,21.9 52.12,21.26 53.07,20.31 56.25,20.31 60.69,24.75 60.69,33.01 54.66,39.04 54.66,57.46 56.88,59.68 63.87,59.68 67.36,63.17 67.36,84.13 60.22,91.27 53.71,91.27 52.12,92.86 52.12,96.83 48.63,100.32 37.83,100.32 31.48,93.97
ADC1  (via drill 0.33)
  Top 0.305: C17.2 R25.2 IC4.7 15.93,92.06 29.26,92.06 31.8,89.52 v49.58,89.52 | v64.82,26.02 v60.38,21.58
  Bottom 0.305: v60.38,21.58 59.11,22.85 57.84,22.85 54.66,26.02 53.39,26.02 U1.23 | v64.82,26.02 64.82,42.54 66.09,43.8 66.09,52.7 67.36,53.97 67.36,64.12 59.74,71.74 59.74,87.62 57.84,89.52 v49.58,89.52
ADC2  (via drill 0.33)
  Top 0.305: C20.2 R30.2 IC4.8 17.2,89.52 v30.53,89.52 | v40.69,32.38 44.5,32.38 49.58,27.29 50.85,27.29 U1.24 | v27.99,68.57 27.99,70.47 v31.17,73.65
  Bottom 0.305: v40.69,32.38 36.88,36.19 36.88,37.46 33.71,40.63 31.8,40.63 27.99,44.44 v27.99,68.57 | v31.17,73.65 33.07,75.55 33.07,79.36 30.53,81.91 v30.53,89.52
ADC3  (via drill 0.33)
  Top 0.305: C21.2 R34.2 IC4.14 | v43.87,31.1 48.31,26.66 U1.25 | v29.9,68.57 29.9,71.11 v32.44,73.65
  Bottom 0.305: v43.87,31.1 43.87,33.01 34.98,41.9 31.8,41.9 30.53,43.17 30.53,67.93 v29.9,68.57 | v32.44,73.65 34.34,75.55 34.34,79.36 31.8,81.91 R34.2
ADC4
  Top 0.305: C22.2 R38.2 IC5.1
  Bottom 0.305: U1.26 45.77,39.36 35.61,49.52 35.61,62.22 C22.2
ADC5  (via drill 0.33)
  Top 0.305: IC5.7 R42.2 C23.2 | v12.75,44.44 v21.64,44.44
  Bottom 0.305: v21.64,44.44 26.09,44.44 41.96,28.56 41.96,27.93 43.23,26.66 U1.27 | v12.75,44.44 12.75,50.16 7.67,55.23 7.67,62.22 C23.2
ADC6  (via drill 0.33)
  Top 0.305: IC5.8 R46.2 C24.2 | v17.83,43.17 v20.37,43.17
  Bottom 0.305: U1.28 40.69,28.56 26.09,43.17 v20.37,43.17 | v17.83,43.17 17.83,46.98 C24.2
ADC9
  Top 0.305: IC5.14 R50.2 C25.2 35.61,54.6 35.61,50.47 33.07,47.93 U1.31
AINL
  Top 0.305: U1.16 R10.2
AINR
  Top 0.305: U1.17 R9.2
AOUTL
  Top 0.305: U1.18 R18.1
AOUTR
  Top 0.305: U1.19 R17.1
DAC1
  Top 0.305: U1.30 R68.1
DAC2
  Top 0.305: U1.29 R69.1
N$1
  Top 0.305: R27.1 15.61,104.13 14.34,102.86 11.16,102.86 2.59,94.29 2.59,90.16 CV2A.1
N$2
  Top 0.305: IC1.14 R6.2 C7.2 R1.1
N$3
  Top 0.305: R2.1 C6.2 R4.2 IC1.1
N$4
  Top 0.305: C4.1 R2.2 R3.1 IC1.6
N$5
  Top 0.305: IC1.9 R5.1 R1.2 C5.1
N$6
  Top 0.305: AIN1.1 R7.1
N$7
  Top 0.305: AIN2.1 R8.1
N$8
  Top 0.305: C7.1 64.82,82.54 | 64.82,82.54 R6.1 | 64.82,82.54 R8.2 59.11,88.25 57.84,88.25 IC1.13
N$9  (via drill 0.33)
  Top 0.305: IC1.8 R5.2 C5.2 | v62.92,16.5 v56.57,16.5 | v53.39,77.46 v57.2,77.46
  Bottom 0.305: R10.1 53.39,16.5 v56.57,16.5 | v62.92,16.5 62.92,43.17 62.28,43.8 62.28,67.3 57.2,72.38 v57.2,77.46 | v53.39,77.46 44.5,77.46 C5.2
N$10  (via drill 0.33)
  Top 0.305: C4.2 R3.2 IC1.7 | v62.92,15.23 v59.11,15.23
  Bottom 0.305: R9.1 54.66,17.77 56.57,17.77 v59.11,15.23 | v62.92,15.23 67.36,19.67 67.36,52.7 68.63,53.97 68.63,64.12 62.28,70.47 62.28,94.6 56.57,100.32 49.58,100.32 IC1.7
N$11
  Top 0.305: AOUT1.1 R19.2
N$12
  Top 0.305: R14.2 R12.1 47.04,78.73 | 47.04,78.73 C12.2 | IC3.7 45.14,71.74 46.25,71.74 47.04,72.54 47.04,78.73
N$13
  Top 0.305: 63.55,96.51 R4.1 | 63.55,96.51 R7.2 59.11,92.06 57.84,92.06 IC1.2 | 63.55,96.51 C6.1
N$14
  Top 0.305: R12.2 C10.1 R13.1 IC3.2
N$15
  Top 0.305: R16.2 R11.1 C13.2 IC3.8
N$16
  Top 0.305: R11.2 C11.1 R15.1 IC3.13
N$17
  Top 0.305: IC3.9 43.87,67.93 42.76,67.93 40.69,65.87 R16.1 C13.1 38.15,51.9 34.34,48.09 34.34,36.5 36.09,34.76 52.28,34.76 59.9,27.14 59.9,26.02 58.95,25.07 57.84,25.07 54.34,21.58 R18.2
N$18
  Top 0.305: IC3.14 R20.1 63.55,63.49 | 63.55,63.49 R15.2 | C11.2 63.55,63.49
N$19
  Top 0.305: IC3.1 R19.1 64.82,77.46 | R13.2 64.82,77.46 | 64.82,77.46 C10.2
N$20  (via drill 0.33)
  Top 0.305: C12.1 41.96,77.46 | 41.96,77.46 IC3.6 | 41.96,77.46 R14.1 40.69,73.65 44.5,69.84 v49.58,69.84 | v59.11,21.58 61.65,24.12 v61.65,41.9
  Bottom 0.305: v59.11,21.58 R17.2 | v61.65,41.9 59.74,43.8 59.74,67.3 57.2,69.84 v49.58,69.84
N$21
  Top 0.305: AOUT2.1 R20.2
N$22  (via drill 0.33)
  Top 0.305: R22.1 22.91,97.78 v15.29,97.78 | v15.29,91.43 8.94,91.43 v5.13,95.24
  Bottom 0.305: v15.29,91.43 v15.29,97.78 | CV1A.1 2.59,95.24 v5.13,95.24
N$23
  Top 0.305: U1.15 14_RX.1
N$24
  Top 0.305: R21.1 32.99,100.4 | 32.99,100.4 C16.1 | R23.2 29.1,96.51 | R23.2 IC4.2 | R23.2 R24.2 | 29.1,96.51 32.99,100.4 | 29.1,96.51 R22.2
N$25
  Top 0.305: R59.1 51.96,20.31 53.71,18.56 68.16,18.56 GTIN2.1
N$26
  Bottom 0.305: R28.1 14.02,100.95 2.59,89.52 2.59,87.62 CV2B.1
N$27  (via drill 0.33)
  Top 0.305: R23.1 21.64,99.05 v13.39,99.05 | v7.04,95.88 v10.21,95.88
  Bottom 0.305: v10.21,95.88 v13.39,99.05 | v7.04,95.88 2.59,91.43 CV1B.1
N$28
  Top 0.305: U1.14 13_TX.1
N$29
  Top 0.305: C17.1 10.29,100.4 | 10.29,100.4 R25.1 | R27.2 R26.2 | R27.2 14.18,96.51 | R27.2 IC4.6 | 14.18,96.51 10.29,100.4 | 14.18,96.51 R28.2
N$30
  Top 0.305: R34.1 32.99,79.92 | 32.99,79.92 C21.1 | R36.2 29.1,83.81 | R36.2 IC4.13 | R36.2 R37.2 | 29.1,83.81 32.99,79.92 | 29.1,83.81 R35.2
N$31  (via drill 0.33)
  Top 0.305: v18.47,79.36 v29.26,79.36
  Bottom 0.305: v29.26,79.36 R35.1 | v18.47,79.36 12.75,79.36 12.12,80 2.59,80 CV4A.1
N$32
  Top 0.305: R36.1 26.72,75.24 25.45,73.97 25.45,73.33 24.5,72.38 15.45,72.38 14.66,71.59 12.59,71.59 9.58,74.6 2.91,74.6 CV4B.1
N$33
  Top 0.305: U1.11 10_MOSI.1
N$34
  Top 0.305: R32.1 16.56,75.24 15.29,73.97 15.29,73.33 14.34,72.38 12.91,72.38 9.89,75.4 7.2,75.4 CV3B.1
N$35
  Top 0.305: R31.1 8.94,76.19 CV3A.1
N$36
  Top 0.305: C20.1 10.29,79.92 | 10.29,79.92 R30.1 | R32.2 R33.2 | R32.2 IC4.9 | R32.2 14.18,83.81 | 14.18,83.81 10.29,79.92 | 14.18,83.81 R31.2
N$37
  Top 0.305: U1.10 9_MISO.1
N$38
  Top 0.305: R38.1 32.99,69.92 | 32.99,69.92 C22.1 | R40.2 29.1,66.03 | R40.2 IC5.2 | R40.2 R41.2 | 29.1,66.03 32.99,69.92 | 29.1,66.03 R39.2
N$39
  Top 0.305: U1.9 8_SCK.1
N$40
  Top 0.305: R40.1 26.72,72.7 20.37,66.35 20.37,62.38 19.58,61.59 9.26,61.59 2.59,68.25 2.59,69.84 CV5B.1
N$41  (via drill 0.33)
  Top 0.305: v20.37,80.63 v29.26,80.63
  Bottom 0.305: R39.1 30.53,74.92 30.53,79.36 v29.26,80.63 | v20.37,80.63 20.37,80 17.83,77.46 5.13,77.46 CV5A.1
N$42
  Top 0.305: U1.8 7_CS.1
N$43
  Top 0.305: C23.1 10.29,69.92 | 10.29,69.92 R42.1 | R44.2 R43.2 | R44.2 14.18,66.03 | R44.2 IC5.6 | 14.18,66.03 10.29,69.92 | 14.18,66.03 R45.2
N$44
  Top 0.305: R44.1 16.56,74.13 17.83,75.4 17.83,76.51 19.58,78.25 30.69,78.25 31.48,77.46 37.2,77.46 38.15,76.51 38.15,65.71 33.23,60.79 8.94,60.79 1.32,68.41 CV6A.1
N$45
  Top 0.305: R45.1 14.02,74.6 15.29,75.87 15.29,77.62 22.91,85.24 22.91,87.46 23.7,88.25 34.02,88.25 35.61,86.67 35.61,80.16 38.95,76.82 38.95,65.39 33.55,60 7.35,60 CV6B.1
N$46
  Top 0.305: R50.1 32.99,49.44 | 32.99,49.44 C25.1 | R52.2 IC5.13 | R52.2 29.1,53.33 | R52.2 R53.2 | 29.1,53.33 32.99,49.44 | 29.1,53.33 R51.2
N$47
  Top 0.305: U1.7 6_SD_CLK.1
N$48
  Top 0.305: R51.1 28.79,45.71 23.7,40.63 14.81,40.63 8.46,46.98 8.46,48.57 2.59,54.44 2.59,57.14 CV8A.1
N$49
  Top 0.305: R52.1 27.67,45.71 28.94,46.98 29.58,46.98 30.53,46.03 30.53,45.39 23.23,38.09 14.81,38.09 7.67,45.23 7.67,48.25 1.32,54.6 CV8B.1
N$50
  Top 0.305: R48.1 12.43,45.71 3.39,54.76 3.39,58.89 CV7B.1
N$51
  Top 0.305: R47.1 16.56,49.2 20.37,53.01 20.37,56.98 18.78,58.57 6.24,58.57 CV7A.1
N$52
  Top 0.305: R46.1 10.29,49.44 | 10.29,49.44 C24.1 | R47.2 R49.2 | R47.2 IC5.9 | R47.2 14.18,53.33 | 14.18,53.33 10.29,49.44 | 14.18,53.33 R48.2
N$53
  Top 0.305: U1.6 5_SD_CMD.1
N$54
  Top 0.305: R55.1 67.36,17.77 GTIN1.1
N$55
  Top 0.305: R55.2 R56.2 34.98,14.6 Q1.2
N$56
  Top 0.305: 29.26,16.5 Q1.1 | R54.1 29.26,16.5 | 29.26,16.5 R57.1
N$58
  Top 0.305: 35.61,20.94 R60.2 | 35.61,20.94 Q2.2 | 35.61,20.94 R59.2
N$59
  Top 0.305: Q2.1 R58.1 R61.1
N$61
  Top 0.305: U1.5 4_SD_D0.1
N$62
  Top 0.305: U1.4 3_SD_D1.1
N$63
  Top 0.305: U1.3 2_SD_D2.1
N$64
  Top 0.305: U1.2 1_SD_D3.1
N$65
  Top 0.305: U1.1 0.1
N$66
  Top 0.305: U1.12 11.1
N$67
  Top 0.305: U1.13 12.1
N$69
  Top 0.305: R65.2 IC6.1 R63.1
N$70
  Top 0.305: R63.2 R64.1 IC6.6
N$71
  Top 0.305: R62.1 IC6.14 R67.2
N$72
  Top 0.305: IC6.9 R66.1 R62.2
N$73
  Top 0.305: R67.1 IC6.13 38.15,44.44 R69.2
N$74
  Top 0.305: R66.2 63.55,54.6 R71.1 IC6.8
N$75
  Top 0.305: R64.2 64.74,43.25 | 64.74,43.25 R70.1 | IC6.7 59.42,44.44 60.69,43.17 64.66,43.17 64.74,43.25
N$76
  Top 0.305: IC6.2 R65.1 49.58,40.63 49.58,39.04 46.09,35.55 37.83,35.55 36.56,36.82 R68.2
N$77
  Top 0.305: R70.2 66.09,52.06 CVOUT1.1
N$78
  Top 0.305: R71.2 61.96,44.44 64.5,46.98 CVOUT2.1
PE
  Top 0.305: C19.1 36.88,69.05 35.29,70.63 35.29,73.81 35.14,73.97 34.18,73.97 U2.1
  Bottom 0.406: GND2.1 GND.1 | C3.- 15.29,33.52 14.03,32.26 14.03,30.61 U1.40 6.27,26.79 | 3.86,29.2 IC2.2 | Q2.3 32.18,22.85 31.01,24.02 | Q1.3 Q2.3 | Q2.3 33.96,22.85 35.13,24.02 36.09,24.02 37.26,22.85 R60.1 43.23,21.96 44.4,20.79 44.4,17.29 43.23,16.12 R56.1 56.31,15.23 57.1,14.44 57.1,12.67 U1.20 | IC5.11 IC5.12 | IC5.5 19.28,63.49 | 24,63.49 IC5.3 | 20.27,65.55 20.27,65.93 20.37,66.03 | 22.91,72.38 33.07,72.38 C19.1 | IC3.10 48.49,66.03 | 53.22,66.03 IC3.12 | IC3.5 48.49,73.65 | 53.22,73.65 IC3.3 | IC1.12 53.22,86.35 | 48.49,86.35 IC1.10 IC1.5 48.49,93.97 50.37,92.09 51.34,92.09 53.22,93.97 IC1.3 C8.1 | IC4.5 19.28,93.97 | 24,93.97 IC4.3 22.81,95.34 22.81,96.99 21.64,98.16 C18.1 | C14.2 55.93,62.6 57.1,61.43 57.1,56.66 55.93,55.49 C28.2 | IC6.10 53.22,52.06 | 48.49,52.06 IC6.12 | IC6.3 48.49,44.44 | 53.22,44.44 IC6.5
  pour Bottom: 69.9,-0.01 0.05,-0.01 0.05,105.4 69.9,105.4

### Text on the board
tNames: Rob Ellis 2020